# Altium project BauhallenUhr.PrjPcb
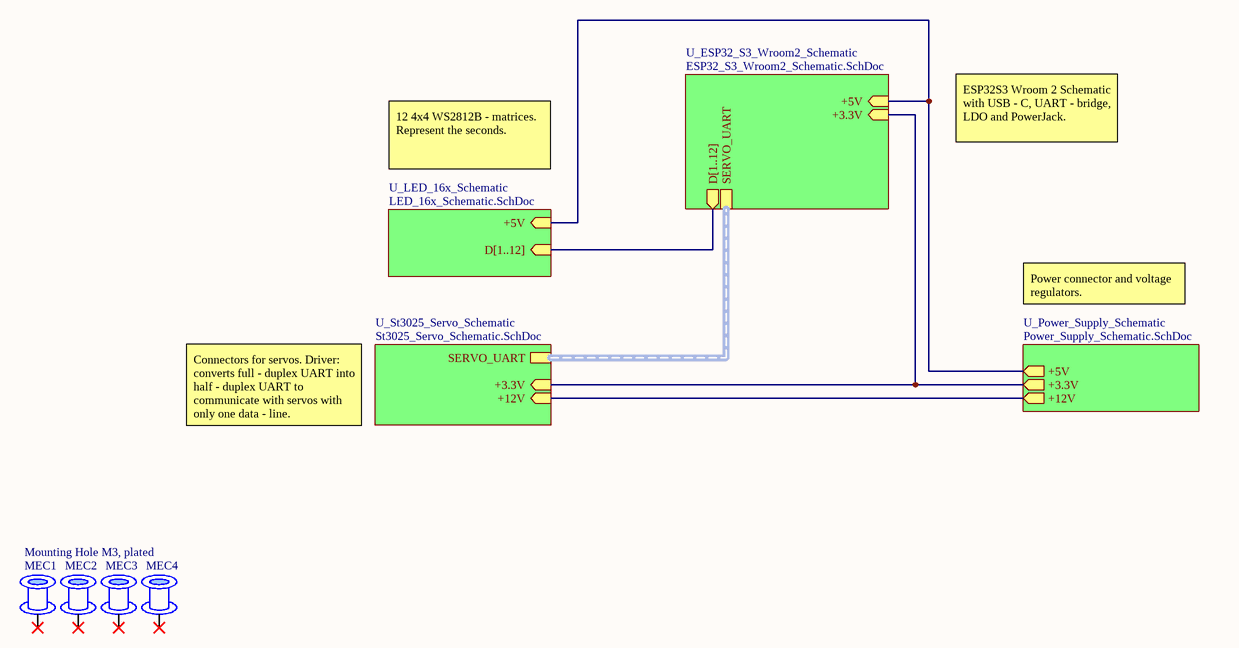
[diagram p0: Blackbox_BauhallenUhr_Schematic.SchDoc]
Author: Manuel Hueppi; Departement: DBAUG; Institut: IBK; Revision: V2.0
6 sheets, 130 parts. Net scope: hierarchical (ports join the sheet entries above them; power ports are global).
Board file: BauhallenUhr_Variante_4.PcbDoc
Sheets:
  Blackbox_BauhallenUhr_Schematic.SchDoc
    U_St3025_Servo_Schematic = St3025_Servo_Schematic.SchDoc
    U_ESP32_S3_Wroom2_Schematic = ESP32_S3_Wroom2_Schematic.SchDoc
    U_LED_16x_Schematic = LED_16x_Schematic.SchDoc
    U_Power_Supply_Schematic = Power_Supply_Schematic.SchDoc
  Brightness_Sensor_Schematic.SchDoc

## Sheet Blackbox_BauhallenUhr_Schematic.SchDoc
size A4; DocumentNumber: 1; SheetNumber: 1; SheetTotal: 5

### Parts
MEC1  Mounting Hole M3, plated  [Mounting Hole M3, plated]
MEC2  Mounting Hole M3, plated  [Mounting Hole M3, plated]  (value not drawn)
MEC3  Mounting Hole M3, plated  [Mounting Hole M3, plated]  (value not drawn)
MEC4  Mounting Hole M3, plated  [Mounting Hole M3, plated]  (value not drawn)

### Sub-sheets
U_ESP32_S3_Wroom2_Schematic = ESP32_S3_Wroom2_Schematic.SchDoc: SERVO_UART (harness SERVO_UART), D[1..12] (out), +5V (in), +3.3V (in)
U_LED_16x_Schematic = LED_16x_Schematic.SchDoc: D[1..12] (in), +5V (in)
U_Power_Supply_Schematic = Power_Supply_Schematic.SchDoc: +12V (out), +3.3V (out), +5V (out)
U_St3025_Servo_Schematic = St3025_Servo_Schematic.SchDoc: SERVO_UART (harness SERVO_UART), +3.3V (in), +12V (in)

### Nets
+3.3V: sheet U_St3025_Servo_Schematic/+3.3V, sheet U_ESP32_S3_Wroom2_Schematic/+3.3V, sheet U_Power_Supply_Schematic/+3.3V
+5V: sheet U_ESP32_S3_Wroom2_Schematic/+5V, sheet U_LED_16x_Schematic/+5V, sheet U_Power_Supply_Schematic/+5V
+12V: sheet U_St3025_Servo_Schematic/+12V, sheet U_Power_Supply_Schematic/+12V

Not connected (* = marked no-connect by the designer): MEC1 1*; MEC2 1*; MEC3 1*; MEC4 1*

### Buses and harness runs
bus sheet U_ESP32_S3_Wroom2_Schematic/D[1..12] = sheet U_LED_16x_Schematic/D[1..12]
harness sheet U_ESP32_S3_Wroom2_Schematic/SERVO_UART = sheet U_St3025_Servo_Schematic/SERVO_UART

### Notes on the sheet
- 12 4x4 WS2812B - matrices. Represent the seconds.
- ESP32S3 Wroom 2 Schematic with USB - C, UART - bridge, LDO and PowerJack.
- Power connector and voltage regulators.
- Connectors for servos. Driver: converts full - duplex UART into half - duplex UART to communicate with servos with only one data - line.
- Date:
- Title of drawing:
- Time:
- Drawn by:
- Project:
- Revision:
- Institut:
- Departement:
- Page:
- from:
- File:

### Library data of the parts
MEC1-MEC4 = Mounting Hole M3, plated: Mounting Hole for M3 Screw, plated to connect signal

## Sheet St3025_Servo_Schematic.SchDoc
size A4; DocumentNumber: 4; SheetNumber: 4; SheetTotal: 5
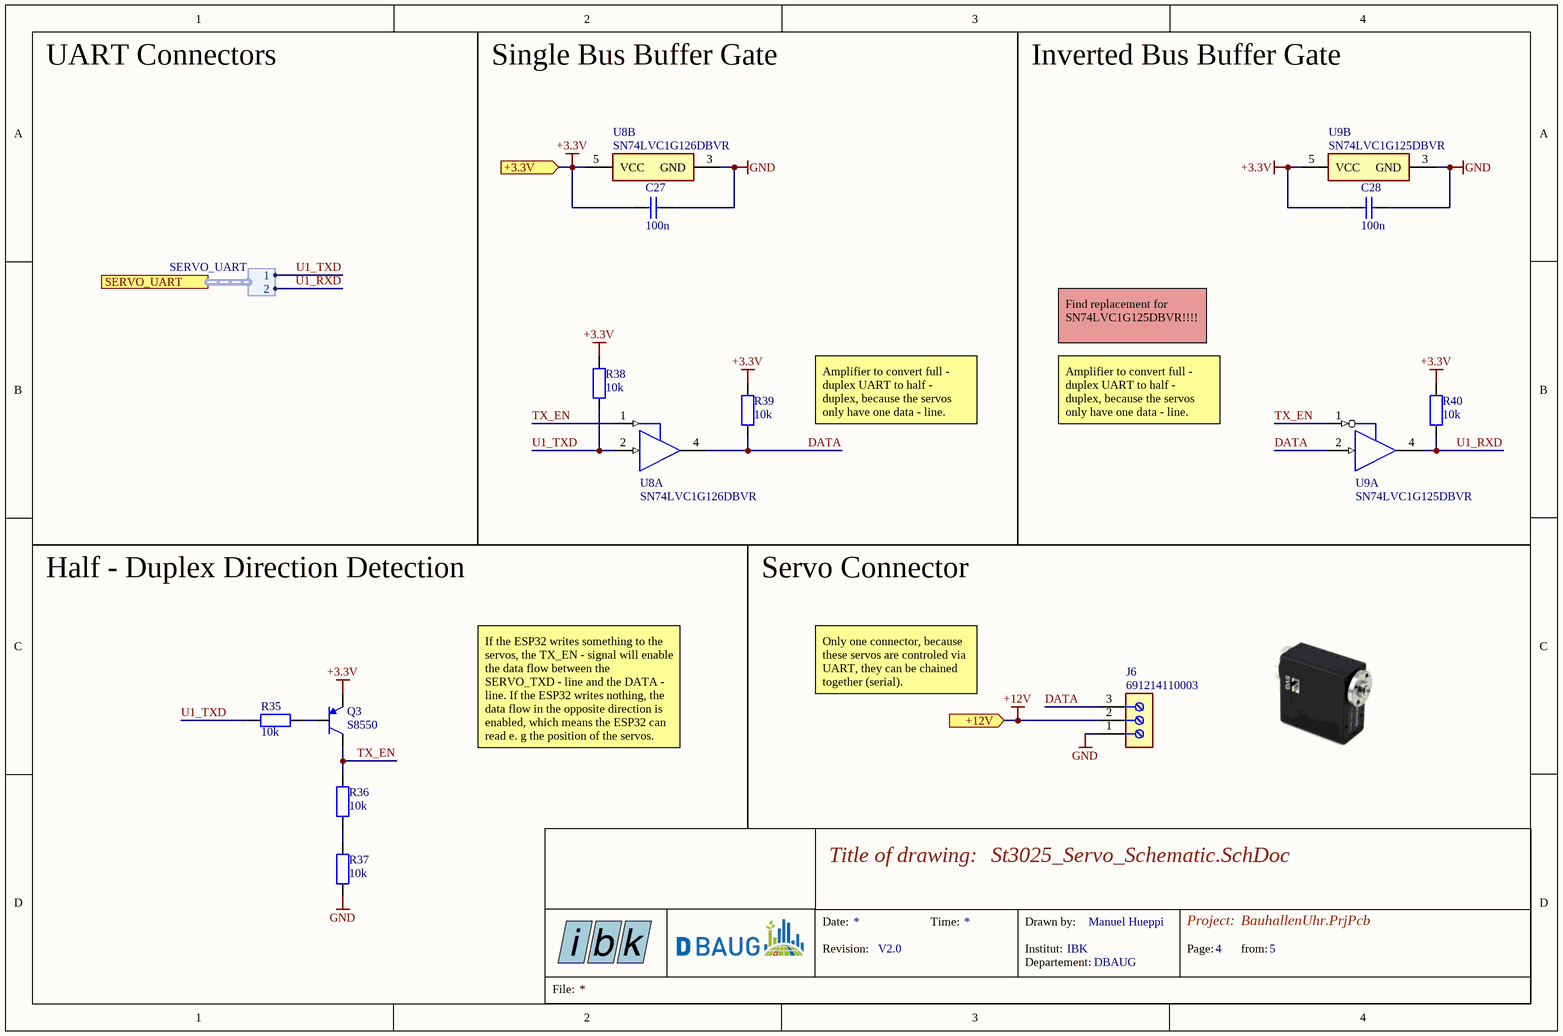
[diagram p1: St3025_Servo_Schematic.SchDoc]

### Parts
(Parts that share a designator on the sheet are numbered #1, #2 ... from top to bottom, then left to right.)
C27  100n  [0603_CAPACITOR]
C28  100n  [0603_CAPACITOR]
J6  691214110003  [Screw_Connector]
Q3  S8550  [PNP_Bipolar_Transistor]
R35  10k  [Resistor_0603]
R36  10k  [Resistor_0603]
R37  10k  [Resistor_0603]
R38#1  10k  [Resistor_0603]
R39#1  10k  [Resistor_0603]
R40#1  10k  [Resistor_0603]
U8  SN74LVC1G126DBVR  [DBV0005A_L_Single_Bus_Buffer_Gate]  (parts A,B of 2)
U9#1  SN74LVC1G125DBVR  [DBV0005A_L_Single_Bus_Buffer_Gate]  (parts A,B of 2)

### Ports
+3.3V (in), +12V (in), SERVO_UART (harness SERVO_UART)

### Harnesses
SERVO_UART: 1, 2

### Nets
+3.3V: C27.2 C28.2 Q3.2(E) R38#1.2 R39#1.2 R40#1.2 U8.5(VCC) U9#1.5(VCC) ; port +3.3V
+12V: J6.2 ; port +12V
GND: C27.1 C28.1 J6.1 R37.1 U8.3(GND) U9#1.3(GND)
DATA: J6.3 R39#1.1 U8.4(Y) U9#1.2(A)
TX_EN: Q3.3(C) R36.2 U8.1(OE) U9#1.1(OE)
U1_RXD: R40#1.1 U9#1.4(Y) ; port SERVO_UART.2
U1_TXD: R35.2 R38#1.1 U8.2(A) ; port SERVO_UART.1
NetQ3_1: Q3.1(B) R35.1
NetR36_1: R36.1 R37.2

### Notes on the sheet
- UART Connectors
- Single Bus Buffer Gate
- Inverted Bus Buffer Gate
- Find replacement for SN74LVC1G125DBVR!!!!
- Amplifier to convert full - duplex UART to half - duplex, because the servos only have one data - line.
- Half - Duplex Direction Detection
- Servo Connector
- Only one connector, because these servos are controled via UART, they can be chained together (serial).
- If the ESP32 writes something to the servos, the TX_EN - signal will enable the data flow between the SERVO_TXD - line and the DATA - line. If the ESP32 writes nothing, the data flow in the opposite direction is enabled, which means the ESP32 can read e. g the position of the servos.
- Date:
- Title of drawing:
- Time:
- Drawn by:
- Project:
- Revision:
- Institut:
- Departement:
- Page:
- from:
- File:

### Library data of the parts
C27 C28 = Capacitor_0603: 0603
J6 = Screw_Connector: 691214110003 Wurth Elektronik
Q3 = PNP_Bipolar_Transistor: Bipolar (BJT) Transistor PNP 25 V 500 mA 150MHz 300 mW Surface Mount SOT-23.
R35-R37 R38#1 R39#1 R40#1 = Resistor_0603: 0603
U8 = Single_Bus_Buffer_Gate: Single Bus Buffer Gate With 3-State Outputs, DBV0005A, LARGE T&R.; ComponentLink1Description: Supplier; ComponentLink1URL: https://www.digikey.com/en/products/detail/texas-instruments/SN74LVC1G126DBVR/385722
U9#1 = Single_Bus_Buffer_Gate_Inverted: Single Bus Buffer Gate With 3-State Outputs, DBV0005A, LARGE T&R.; ComponentLink1Description: Supplier; ComponentLink1URL: *

## Sheet ESP32_S3_Wroom2_Schematic.SchDoc
size A3; DocumentNumber: 3; SheetNumber: 3; SheetTotal: 5
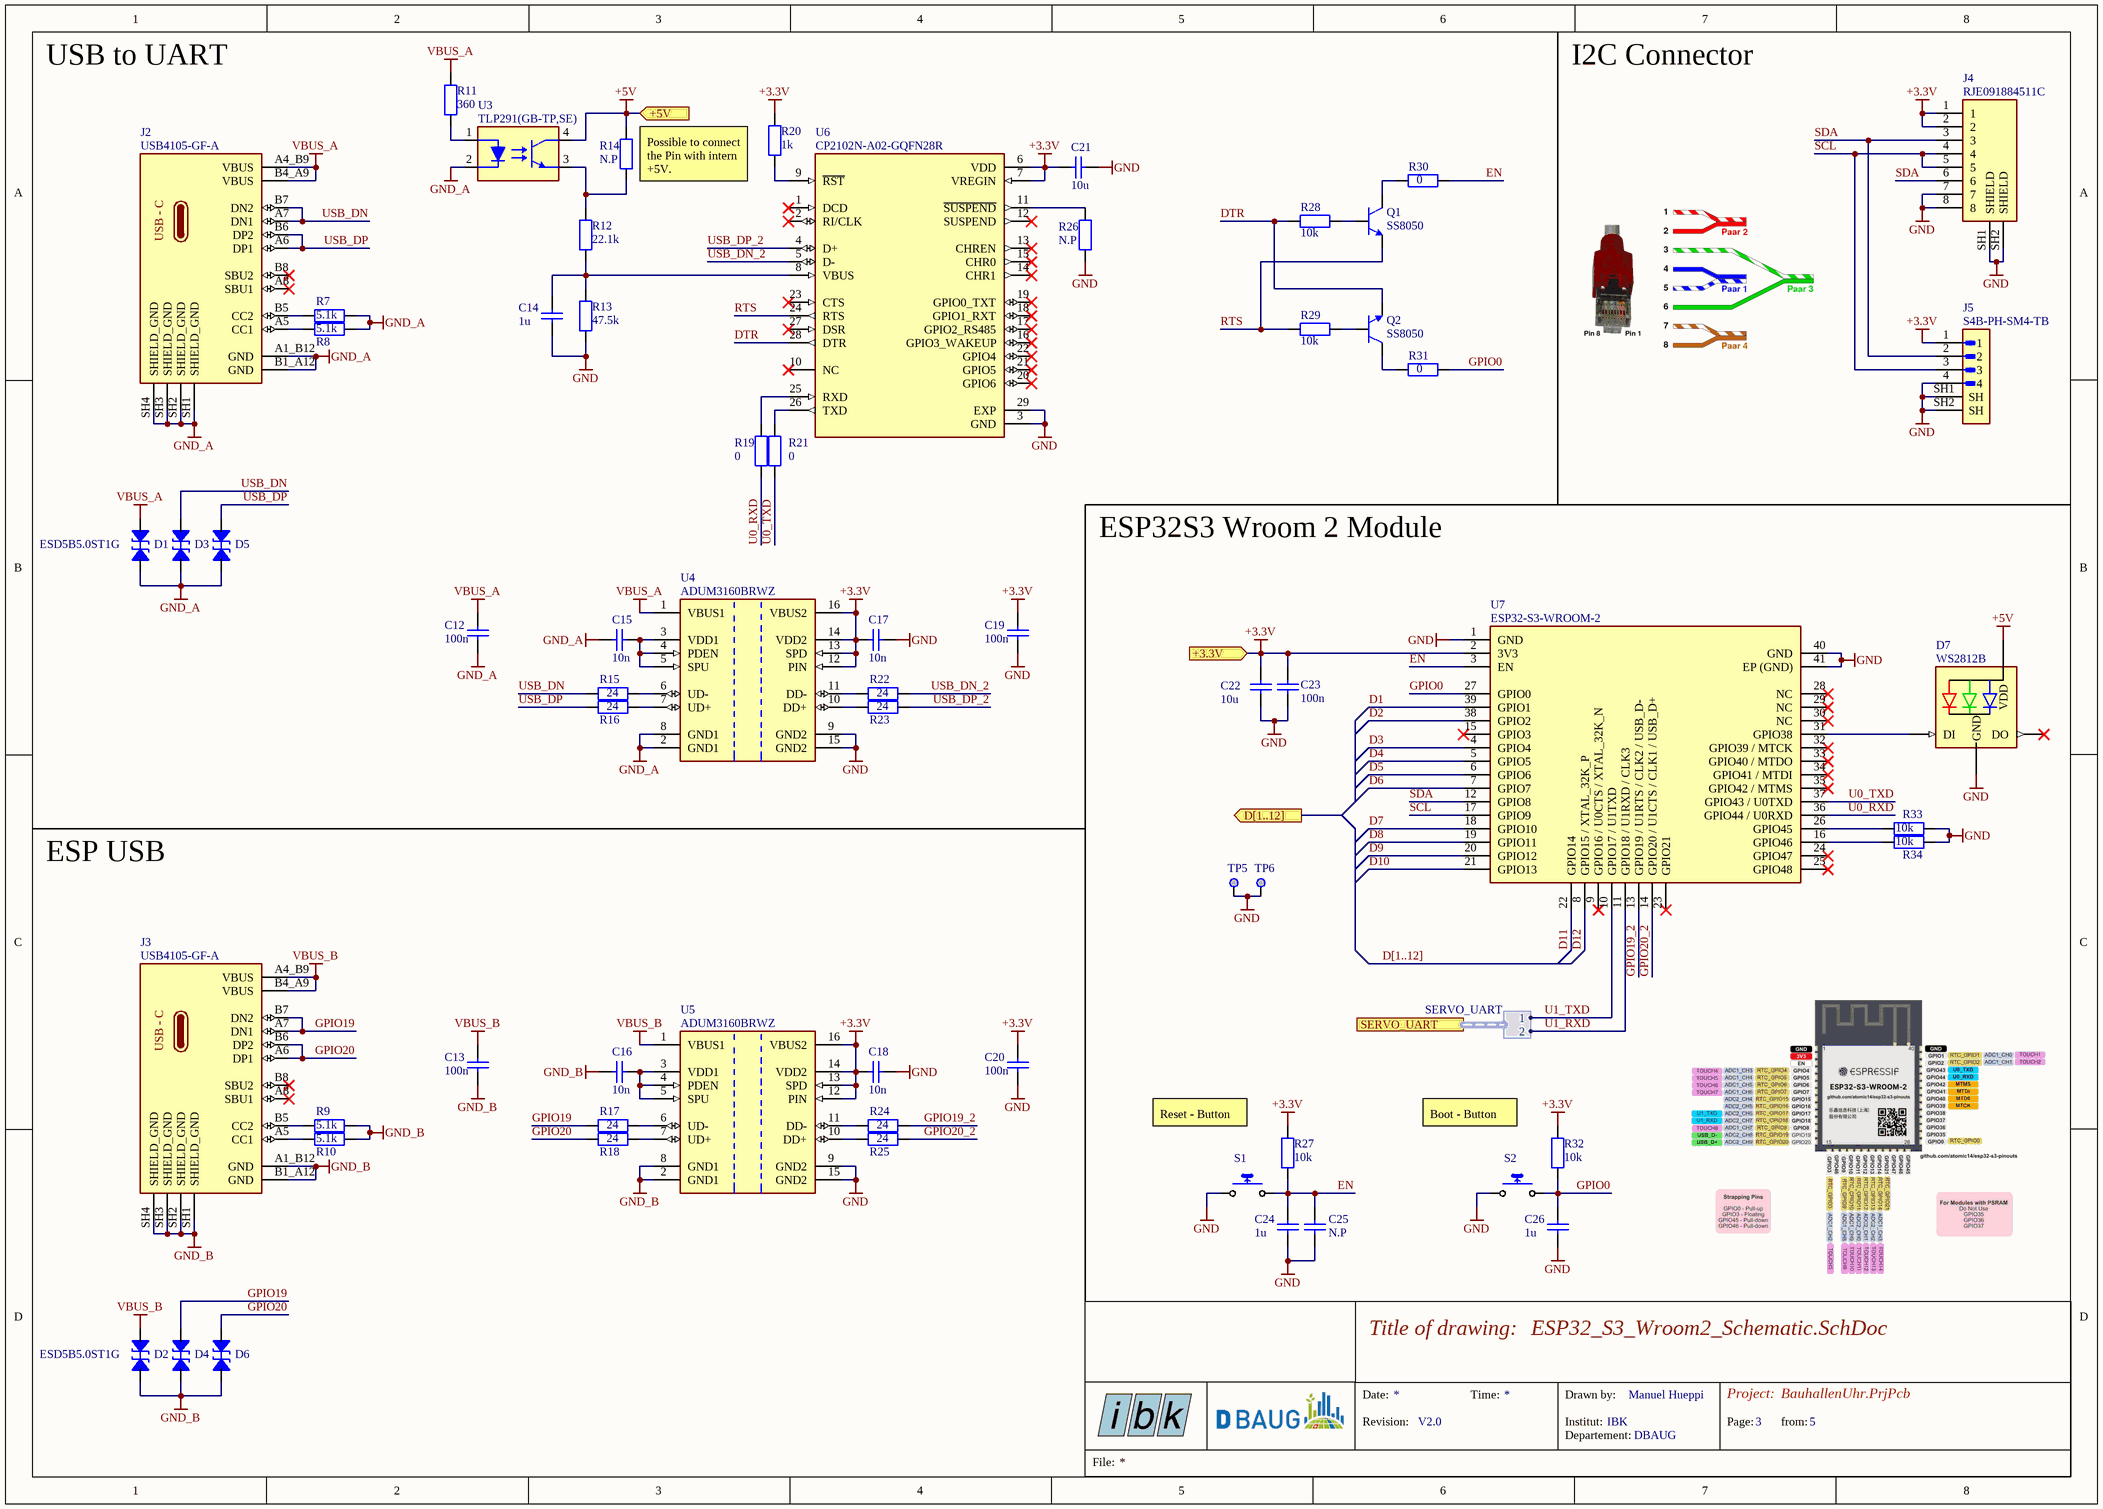
[diagram p2: ESP32_S3_Wroom2_Schematic.SchDoc]

### Parts
(Parts that share a designator on the sheet are numbered #1, #2 ... from top to bottom, then left to right.)
C12  100n  [0603_CAPACITOR]
C13  100n  [0603_CAPACITOR]
C14  1u  [0603_CAPACITOR]
C15  10n  [0603_CAPACITOR]
C16  10n  [0603_CAPACITOR]
C17  10n  [0603_CAPACITOR]
C18  10n  [0603_CAPACITOR]
C19  100n  [0603_CAPACITOR]
C20  100n  [0603_CAPACITOR]
C21  10u  [Capacitor_0805]
C22#1  10u  [Capacitor_0805]
C23#1  100n  [0603_CAPACITOR]
C24  1u  [0603_CAPACITOR]
C25  N.P  [Capacitor_1206]
C26  1u  [0603_CAPACITOR]
D1  ESD5B5.0ST1G  [ESD_Protecction_Diode]
D2  ESD5B5.0ST1G  [ESD_Protecction_Diode]
D3  ESD5B5.0ST1G  [ESD_Protecction_Diode]  (value not drawn)
D4  ESD5B5.0ST1G  [ESD_Protecction_Diode]  (value not drawn)
D5  ESD5B5.0ST1G  [ESD_Protecction_Diode]  (value not drawn)
D6  ESD5B5.0ST1G  [ESD_Protecction_Diode]  (value not drawn)
D7  WS2812B  [WS2812B]
J2  USB4105-GF-A  [USB4105-GF-A]
J3  USB4105-GF-A  [USB4105-GF-A]
J4  RJE091884511C  [RJ45]
J5  S4B-PH-SM4-TB  [Connector_SMD_Lying]
Q1  SS8050  [NPN_Bipolar_Transistor]
Q2  SS8050  [NPN_Bipolar_Transistor]
R7  5.1k  [Resistor_0603]
R8  5.1k  [Resistor_0603]
R9  5.1k  [Resistor_0603]
R10  5.1k  [Resistor_0603]
R11  360  [Resistor_0603]
R12  22.1k  [Resistor_0603]
R13  47.5k  [Resistor_0603]
R14  N.P  [1206_Resistor]
R15  24  [Resistor_0603]
R16  24  [Resistor_0603]
R17  24  [Resistor_0603]
R18  24  [Resistor_0603]
R19  0  [1206_Resistor]
R20  1k  [Resistor_0603]
R21  0  [1206_Resistor]
R22  24  [Resistor_0603]
R23  24  [Resistor_0603]
R24  24  [Resistor_0603]
R25  24  [Resistor_0603]
R26  N.P  [1206_Resistor]
R27  10k  [Resistor_0603]
R28  10k  [Resistor_0603]
R29  10k  [Resistor_0603]
R30  0  [1206_Resistor]
R31  0  [1206_Resistor]
R32  10k  [Resistor_0603]
R33  10k  [Resistor_0603]
R34  10k  [Resistor_0603]
S1  ?  [PTS636SK25SMTR]  (value not drawn)
S2  ?  [PTS636SK25SMTR]  (value not drawn)
TP5  Testpoint S2761-46R  [Testpoint S2761-46R]  (value not drawn)
TP6  Testpoint S2761-46R  [Testpoint S2761-46R]  (value not drawn)
U3  TLP291(GB-TP,SE)  [Optocoupler]
U4  ADUM3160BRWZ  [USB_Digital_Isolator_A]
U5  ADUM3160BRWZ  [USB_Digital_Isolator_A]
U6  CP2102N-A02-GQFN28R  [CP2102N-A02-GQFN28R]
U7  ESP32-S3-WROOM-2  [ESP32-S3-WROOM-2]

### Ports
+3.3V (in), +5V (in), D[1..12] (out), SERVO_UART (harness SERVO_UART)

### Harnesses
SERVO_UART: 1, 2

### Nets
+3.3V: C17.2 C18.2 C19.2 C20.2 C21.2 C22#1.1 C23#1.2 J4.1 J4.2 J5.1 R20.1 R27.2 R32.2 U4.12(PIN) U4.13(SPD) U4.14(VDD2) U4.16(VBUS2) U5.12(PIN) U5.13(SPD) U5.14(VDD2) U5.16(VBUS2) U6.6(VDD) U6.7(VREGIN) U7.2(3V3) ; port +3.3V
+5V: D7.1(VDD) R14.1 U3.4(COL) ; port +5V
GND: C14.1 C17.1 C18.1 C19.1 C20.1 C21.1 C22#1.2 C23#1.1 C24.1 C25.1 C26.1 D7.3(GND) J4.7 J4.8 J4.SH1(SHIELD) J4.SH2(SHIELD) J5.4 J5.SH1(SH) J5.SH2(SH) R13.2 R26.2 R33.1 R34.1 S1.1 S2.1 TP5.1 TP6.1 U4.9(GND2) U4.15(GND2) U5.9(GND2) U5.15(GND2) U6.3(GND) U6.29(EXP) U7.1(GND) U7.40(GND) U7.41(EP_(GND))
GND_A: C12.1 C15.2 D1.A(P$1) D3.A(P$1) D5.A(P$1) J2.A1_B12(GND) J2.B1_A12(GND) J2.SH1(SHIELD_GND) J2.SH2(SHIELD_GND) J2.SH3(SHIELD_GND) J2.SH4(SHIELD_GND) R7.1 R8.1 U3.2(C) U4.2(GND1) U4.8(GND1)
GND_B: C13.1 C16.2 D2.A(P$1) D4.A(P$1) D6.A(P$1) J3.A1_B12(GND) J3.B1_A12(GND) J3.SH1(SHIELD_GND) J3.SH2(SHIELD_GND) J3.SH3(SHIELD_GND) J3.SH4(SHIELD_GND) R9.1 R10.1 U5.2(GND1) U5.8(GND1)
VBUS_A: C12.2 D1.K(P$2) J2.A4_B9(VBUS) J2.B4_A9(VBUS) R11.1 U4.1(VBUS1)
VBUS_B: C13.2 D2.K(P$2) J3.A4_B9(VBUS) J3.B4_A9(VBUS) U5.1(VBUS1)
D1: U7.39(GPIO1)
D2: U7.38(GPIO2)
D3: U7.4(GPIO4)
D4: U7.5(GPIO5)
D5: U7.6(GPIO6)
D6: U7.7(GPIO7)
D7: U7.18(GPIO10)
D8: U7.19(GPIO11)
D9: U7.20(GPIO12)
D10: U7.21(GPIO13)
D11: U7.22(GPIO14)
D12: U7.8(GPIO15_/_XTAL_32K_P)
DTR: Q2.2(E) R28.2 U6.28(DTR)
EN: C24.2 C25.2 R27.1 R30.2 S1.2 U7.3(EN)
GPIO0: C26.2 R31.2 R32.1 S2.2 U7.27(GPIO0)
GPIO19: D4.K(P$2) J3.A7(DN1) J3.B7(DN2) R17.2
GPIO19_2: R24.1 U7.13(GPIO19_/_U1RTS_/_CLK2_/_USB_D-)
GPIO20: D6.K(P$2) J3.A6(DP1) J3.B6(DP2) R18.2
GPIO20_2: R25.1 U7.14(GPIO20_/_U1CTS_/_CLK1_/_USB_D+)
RTS: Q1.2(E) R29.2 U6.24(RTS)
SCL: J4.4 J4.5 J5.3 U7.17(GPIO9)
SDA: J4.3 J4.6 J5.2 U7.12(GPIO8)
U0_RXD: R19.1 U7.36(GPIO44_/_U0RXD)
U0_TXD: R21.1 U7.37(GPIO43_/_U0TXD)
U1_RXD: U7.11(GPIO18_/_U1RXD_/_CLK3) ; port SERVO_UART.2
U1_TXD: U7.10(GPIO17_/_U1TXD) ; port SERVO_UART.1
USB_DN: D3.K(P$2) J2.A7(DN1) J2.B7(DN2) R15.2
USB_DN_2: R22.1 U6.5(D-)
USB_DP: D5.K(P$2) J2.A6(DP1) J2.B6(DP2) R16.2
USB_DP_2: R23.1 U6.4(D+)
NetC14_2: C14.2 R12.2 R13.1 U6.8(VBUS)
NetC15_1: C15.1 U4.3(VDD1) U4.4(PDEN) U4.5(SPU)
NetC16_1: C16.1 U5.3(VDD1) U5.4(PDEN) U5.5(SPU)
NetD7_4: D7.4(DI) U7.31(GPIO38)
NetJ2_A5: J2.A5(CC1) R8.2
NetJ2_B5: J2.B5(CC2) R7.2
NetJ3_A5: J3.A5(CC1) R10.2
NetJ3_B5: J3.B5(CC2) R9.2
NetQ1_1: Q1.1(B) R28.1
NetQ1_3: Q1.3(C) R30.1
NetQ2_1: Q2.1(B) R29.1
NetQ2_3: Q2.3(C) R31.1
NetR11_2: R11.2 U3.1(A)
NetR12_1: R12.1 R14.2 U3.3(EMIT)
NetR15_1: R15.1 U4.6(UD-)
NetR16_1: R16.1 U4.7(UD+)
NetR17_1: R17.1 U5.6(UD-)
NetR18_1: R18.1 U5.7(UD+)
NetR19_2: R19.2 U6.25(RXD)
NetR20_2: R20.2 U6.9(~{RST})
NetR21_2: R21.2 U6.26(TXD)
NetR22_2: R22.2 U4.11(DD-)
NetR23_2: R23.2 U4.10(DD+)
NetR24_2: R24.2 U5.11(DD-)
NetR25_2: R25.2 U5.10(DD+)
NetR26_1: R26.1 U6.11(~{SUSPEND})
NetR33_2: R33.2 U7.26(GPIO45)
NetR34_2: R34.2 U7.16(GPIO46)

Not connected (* = marked no-connect by the designer): D7 2(DO)*; J2 A8(SBU1)* B8(SBU2)*; J3 A8(SBU1)* B8(SBU2)*; U6 1(DCD)* 2(RI/CLK)* 10(NC)* 12(SUSPEND)* 13(CHREN)* 14(CHR1)* 15(CHR0)* 16(GPIO3_WAKEUP)* 17(GPIO2_RS485)* 18(GPIO1_RXT)* 19(GPIO0_TXT)* 20(GPIO6)* 21(GPIO5)* 22(GPIO4)* 23(CTS)* 27(DSR)*; U7 9(GPIO16_/_U0CTS_/_XTAL_32K_N)* 15(GPIO3)* 23(GPIO21)* 24(GPIO47)* 25(GPIO48)* 28(NC)* 29(NC)* 30(NC)* 32(GPIO39_/_MTCK)* 33(GPIO40_/_MTDO)* 34(GPIO41_/_MTDI)* 35(GPIO42_/_MTMS)*

### Buses and harness runs
bus D[1..12] = port D[1..12]

### Notes on the sheet
- USB to UART
- I2C Connector
- (near R14) Possible to connect the Pin with intern +5V.
- ESP32S3 Wroom 2 Module
- ESP USB
- (near R27) Reset - Button
- (near R32) Boot - Button
- Date:
- Title of drawing:
- Time:
- Drawn by:
- Project:
- Revision:
- Institut:
- Departement:
- Page:
- from:
- File:
- (in symbol USB4105-GF-A) USB - C

### Library data of the parts
C12-C20 C23#1 C24 C26 = Capacitor_0603: 0603
C21 C22#1 = Capacitor_0805: 0805
C25 = Capacitor_1206: 1206
D1-D6 = ESD_Protection_Diode: ComponentLink1Description: Supplier; ComponentLink1URL: https://www.digikey.com/en/products/detail/onsemi/ESD5B5-0ST1G/1792206
J2 J3 = USB4105-GF-A: USB - C - Port
J4 = RJ45: Jack Modular Connector 8p8c (RJ45, Ethernet) 90Â° Angle (Right) Shielded Cat3.; MF: Amphenol ICC (Commercial Products); SnapEDA_Link: https://www.snapeda.com/parts/RJE091884511C/Amphenol/view-part/?ref=snap; Package: None; System: Connector; MP: RJE091884511C; Check_prices: https://www.snapeda.com/parts/RJE091884511C/Amphenol/view-part/?ref=eda; Parameter 1: *
J5 = Connector_SMD_Lying_Small_Symbol: Connector Header Surface Mount, Right Angle 4 position 0.079 (2.00mm).; ComponentLink1Description: Supplier; ComponentLink1URL: https://www.digikey.ch/de/products/detail/jst-sales-america-inc/S4B-PH-SM4-TB/926657?s=N4IgTCBcDaIMoBYBCBaACgCRXAsglAKkiALoC%2BQA
Q1 Q2 = NPN_Bipolar_Transistor: SS8050 SOT - 23.; ComponentLink1Description: Supplier; ComponentLink1URL: https://www.digikey.com/en/products/detail/guangdong-inmark-electronics-co-ltd/SS8050/28539054
R7-R13 R15-R18 R20 R22-R25 R27-R29 R32-R34 = Resistor_0603: 0603
R14 R19 R21 R26 R30 R31 = Resistor_1206: 1206
S1 S2 = Button
TP5 TP6 = Testpoint S2761-46R: Prüfstecker und Messbuchsen EZ BoardWare S27 SMT Mini Test Terminal, Reel
U3 = Optocoupler: Optoisolator Transistor Output 3750Vrms 1 Channel 4-SO.
U4 U5 = USB_Digital_Isolator: DGT ISOL 2500VRMS 2CH USB 16SOIC.
U6 = CP2102N-A02-GQFN28R: USB to UART bridge.; ComponentLink1Description: Datasheet; ComponentLink1URL: chrome-extension://efaidnbmnnnibpcajpcglclefindmkaj/https://www.silabs.com/documents/public/data-sheets/cp2102n-datasheet.pdf; ComponentLink2Description: Supplierlink; ComponentLink2URL: https://www.digikey.ch/en/products/detail/silicon-laboratories-inc/CP2102N-A02-GQFN28R/9863486?utm_source=findchips&utm_medium=aggregator&utm_campaign=buynow
U7 = ESP32-S3-WROOM-2-N32R16V: Bluetooth, WiFi 802.11b/g/n, Bluetooth v5.0 Transceiver Module 2.4GHz PCB Trace Surface Mount; Manufacturer: Espressif Systems; Latest Revision Made By: Simon Gimple; Latest Revision Note: New Part; Assembly Technology: SMD; Latest Revision Date: 17.10.2025; Manufacturer Part Number: ESP32-S3-WROOM-2-N32R16V; Note Schematic: *; SMS-Lab Part Number: *; Supplier 1: DigiKey; Supplier 2: Mouser; Supplier 3: *; Supplier 1 Part Number: 1965-ESP32-S3-WROOM-2-N32R16VCT-ND; Supplier 2 Part Number: 356-SP32S3WM2N32R16V; Supplier 3 Part Number: *; Value: *; ComponentLink1Description: Show Datasheet on SMS Drive; ComponentLink1URL: P:\Electronic Workshop\Datasheets (Refered in Libraries - Don't Change!)\ESP32-S3-WROOM-2-N32R16V_Digikey_1965-ESP32-S3-WROOM-2-N32R16VCT-ND.pdf

## Sheet LED_16x_Schematic.SchDoc
size A4; DocumentNumber: 5; SheetNumber: 5; SheetTotal: 5
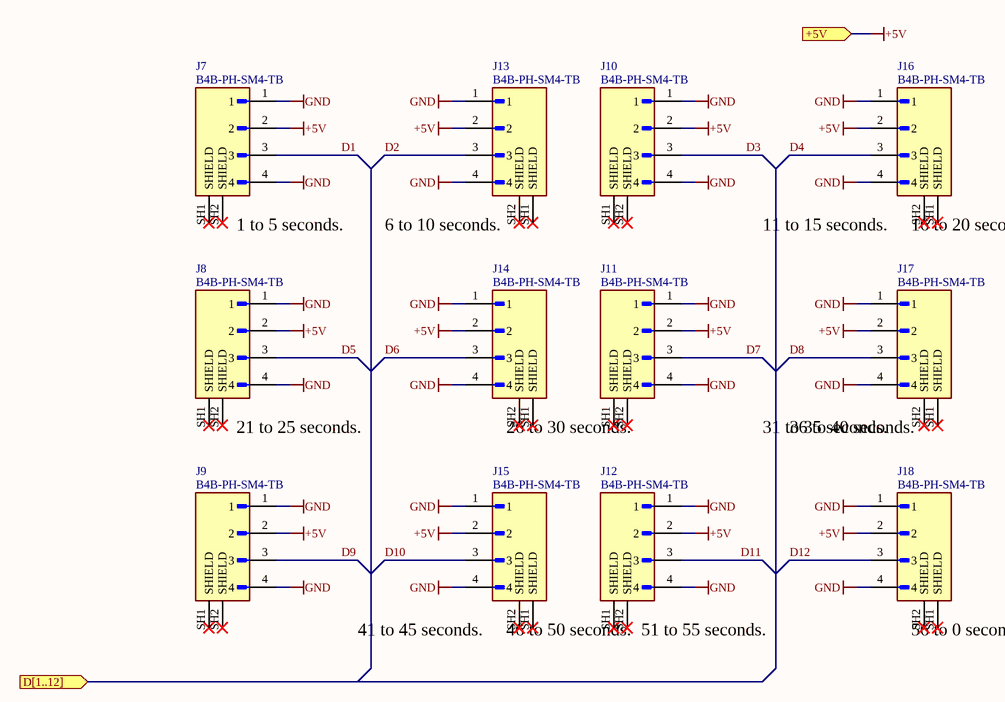
[diagram p3: LED_16x_Schematic.SchDoc]

### Parts
J7  B4B-PH-SM4-TB  [Connector_SMD]
J8  B4B-PH-SM4-TB  [Connector_SMD]
J9  B4B-PH-SM4-TB  [Connector_SMD]
J10  B4B-PH-SM4-TB  [Connector_SMD]
J11  B4B-PH-SM4-TB  [Connector_SMD]
J12  B4B-PH-SM4-TB  [Connector_SMD]
J13  B4B-PH-SM4-TB  [Connector_SMD]
J14  B4B-PH-SM4-TB  [Connector_SMD]
J15  B4B-PH-SM4-TB  [Connector_SMD]
J16  B4B-PH-SM4-TB  [Connector_SMD]
J17  B4B-PH-SM4-TB  [Connector_SMD]
J18  B4B-PH-SM4-TB  [Connector_SMD]

### Ports
+5V (in), D[1..12] (in)

### Nets
+5V: J7.2 J8.2 J9.2 J10.2 J11.2 J12.2 J13.2 J14.2 J15.2 J16.2 J17.2 J18.2 ; port +5V
GND: J7.1 J7.4 J8.1 J8.4 J9.1 J9.4 J10.1 J10.4 J11.1 J11.4 J12.1 J12.4 J13.1 J13.4 J14.1 J14.4 J15.1 J15.4 J16.1 J16.4 J17.1 J17.4 J18.1 J18.4
D1: J7.3
D2: J13.3
D3: J10.3
D4: J16.3
D5: J8.3
D6: J14.3
D7: J11.3
D8: J17.3
D9: J9.3
D10: J15.3
D11: J12.3
D12: J18.3

Not connected (* = marked no-connect by the designer): J7 SH1(SHIELD)* SH2(SHIELD)*; J8 SH1(SHIELD)* SH2(SHIELD)*; J9 SH1(SHIELD)* SH2(SHIELD)*; J10 SH1(SHIELD)* SH2(SHIELD)*; J11 SH1(SHIELD)* SH2(SHIELD)*; J12 SH1(SHIELD)* SH2(SHIELD)*; J13 SH1(SHIELD)* SH2(SHIELD)*; J14 SH1(SHIELD)* SH2(SHIELD)*; J15 SH1(SHIELD)* SH2(SHIELD)*; J16 SH1(SHIELD)* SH2(SHIELD)*; J17 SH1(SHIELD)* SH2(SHIELD)*; J18 SH1(SHIELD)* SH2(SHIELD)*

### Notes on the sheet
- (near J7) 1 to 5 seconds.
- (near J13) 6 to 10 seconds.
- (near J10) 11 to 15 seconds.
- (near J16) 16 to 20 seconds.
- (near J8) 21 to 25 seconds.
- (near J14) 26 to 30 seconds.
- (near J11) 31 to 35 seconds.
- (near J17) 36 to 40 seconds.
- (near J9) 41 to 45 seconds.
- (near J15) 46 to 50 seconds.
- (near J12) 51 to 55 seconds.
- (near J18) 56 to 0 seconds.
- Date:
- Title of drawing:
- Time:
- Drawn by:
- Project:
- Revision:
- Institut:
- Departement:
- Page:
- from:
- File:

### Library data of the parts
J7-J18 = Connector_SMD: CONN HEADER SMD 4POS 2MM.; ComponentLink1Description: Supplier; ComponentLink1URL: https://www.digikey.ch/en/products/detail/jst-sales-america-inc/B4B-PH-SM4-TB/926643

## Sheet Power_Supply_Schematic.SchDoc
size A4; DocumentNumber: 2; SheetNumber: 2; SheetTotal: 5
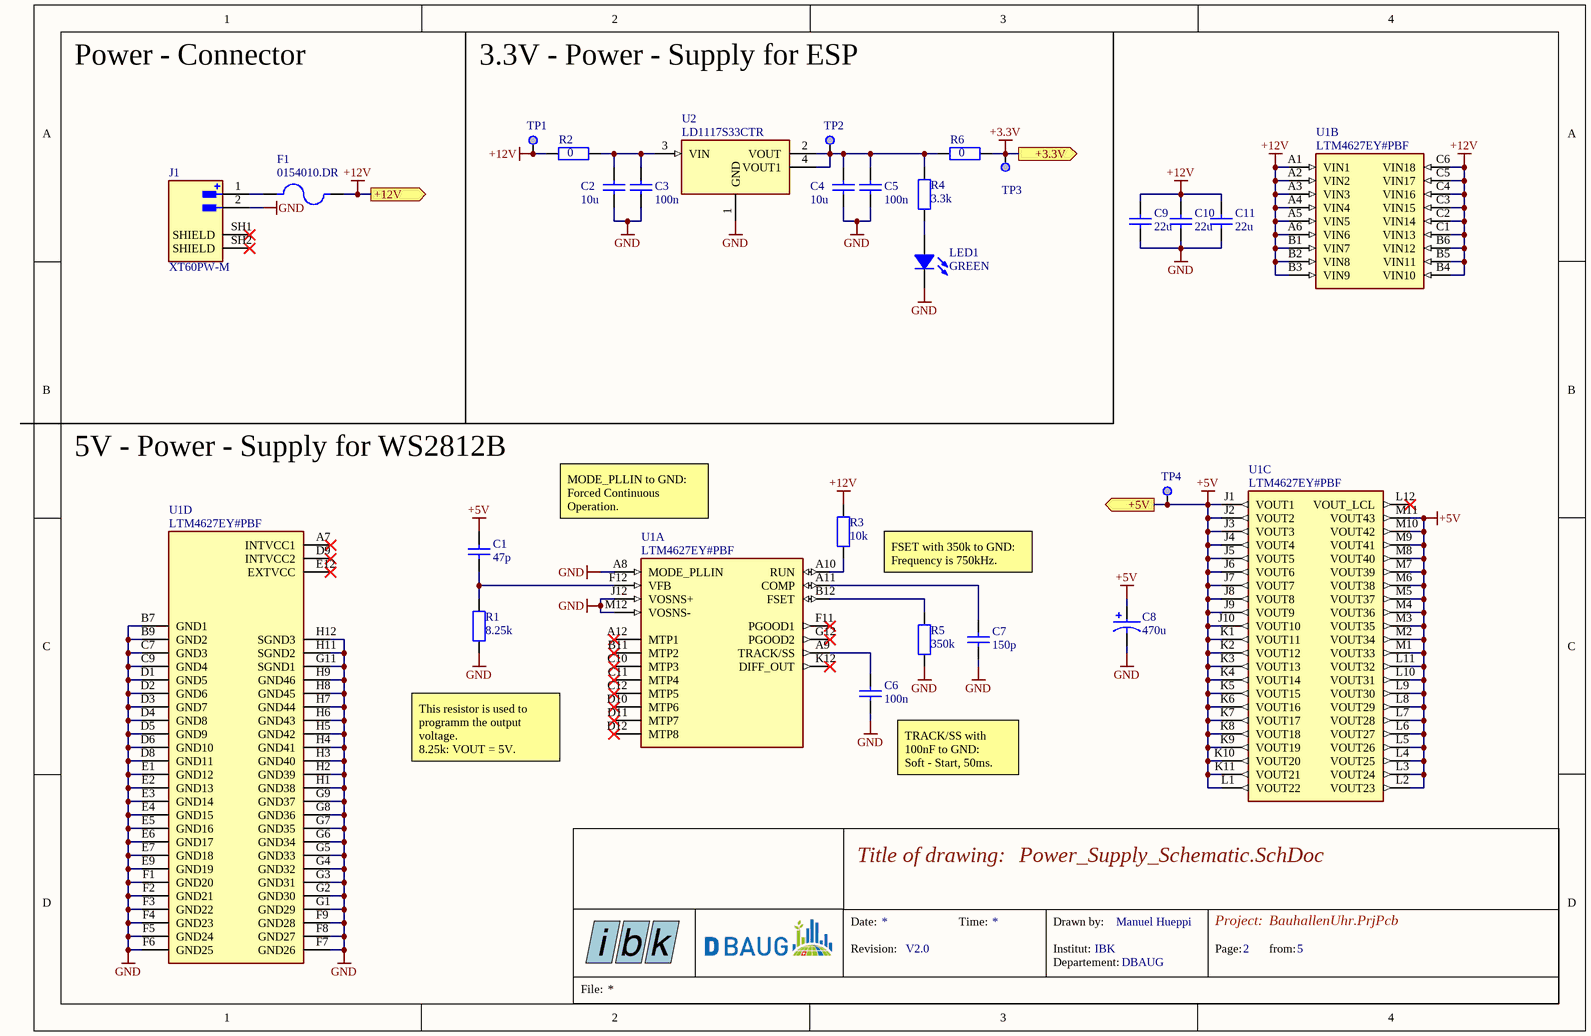
[diagram p4: Power_Supply_Schematic.SchDoc]

### Parts
C1  47p  [0603_CAPACITOR]
C2  10u  [Capacitor_0805]
C3  100n  [0603_CAPACITOR]
C4  10u  [Capacitor_0805]
C5  100n  [0603_CAPACITOR]
C6  100n  [0603_CAPACITOR]
C7  150p  [0603_CAPACITOR]
C8  470u  [Capacitor_Tantalum]
C9  22u  [Capacitor_0805]
C10  22u  [Capacitor_0805]
C11  22u  [Capacitor_0805]
F1  0154010.DR  [Fuse]
J1  XT60PW-M  [PCB_Connector]
LED1  GREEN  [LED_0603, GREEN]
R1  8.25k  [Resistor_0603]
R2  0  [1206_Resistor]
R3  10k  [Resistor_0603]
R4  3.3k  [Resistor_0603]
R5  350k  [Resistor_0603]
R6  0  [1206_Resistor]
TP1  Testpoint S2761-46R  [Testpoint S2761-46R]  (value not drawn)
TP2  Testpoint S2761-46R  [Testpoint S2761-46R]  (value not drawn)
TP3  Testpoint S2761-46R  [Testpoint S2761-46R]  (value not drawn)
TP4  Testpoint S2761-46R  [Testpoint S2761-46R]  (value not drawn)
U1  LTM4627EY#PBF  [DCDC_Converter]  (parts A,B,C,D of 4)
U2  LD1117S33CTR  [LD1117S33CTR]

### Ports
+3.3V (out), +5V (out), +12V (out)

### Nets
+3.3V: R6.2 TP3.1 ; port +3.3V
+5V: C1.2 C8.1 TP4.1 U1.J1(VOUT1) U1.J2(VOUT2) U1.J3(VOUT3) U1.J4(VOUT4) U1.J5(VOUT5) U1.J6(VOUT6) U1.J7(VOUT7) U1.J8(VOUT8) U1.J9(VOUT9) U1.J10(VOUT10) U1.K1(VOUT11) U1.K2(VOUT12) U1.K3(VOUT13) U1.K4(VOUT14) U1.K5(VOUT15) U1.K6(VOUT16) U1.K7(VOUT17) U1.K8(VOUT18) U1.K9(VOUT19) U1.K10(VOUT20) U1.K11(VOUT21) U1.L1(VOUT22) U1.L2(VOUT23) U1.L3(VOUT24) U1.L4(VOUT25) U1.L5(VOUT26) U1.L6(VOUT27) U1.L7(VOUT28) U1.L8(VOUT29) U1.L9(VOUT30) U1.L10(VOUT31) U1.L11(VOUT32) U1.M1(VOUT33) U1.M2(VOUT34) U1.M3(VOUT35) U1.M4(VOUT36) U1.M5(VOUT37) U1.M6(VOUT38) U1.M7(VOUT39) U1.M8(VOUT40) U1.M9(VOUT41) U1.M10(VOUT42) U1.M11(VOUT43) ; port +5V
+12V: C9.2 C10.2 C11.2 F1.2 R2.1 R3.2 TP1.1 U1.A1(VIN1) U1.A2(VIN2) U1.A3(VIN3) U1.A4(VIN4) U1.A5(VIN5) U1.A6(VIN6) U1.B1(VIN7) U1.B2(VIN8) U1.B3(VIN9) U1.B4(VIN10) U1.B5(VIN11) U1.B6(VIN12) U1.C1(VIN13) U1.C2(VIN14) U1.C3(VIN15) U1.C4(VIN16) U1.C5(VIN17) U1.C6(VIN18) ; port +12V
GND: C2.1 C3.1 C4.1 C5.1 C6.1 C7.1 C8.2 C9.1 C10.1 C11.1 J1.2(N) LED1.K R1.1 R5.1 U1.A8(MODE_PLLIN) U1.B7(GND1) U1.B9(GND2) U1.C7(GND3) U1.C9(GND4) U1.D1(GND5) U1.D2(GND6) U1.D3(GND7) U1.D4(GND8) U1.D5(GND9) U1.D6(GND10) U1.D8(GND11) U1.E1(GND12) U1.E2(GND13) U1.E3(GND14) U1.E4(GND15) U1.E5(GND16) U1.E6(GND17) U1.E7(GND18) U1.E9(GND19) U1.F1(GND20) U1.F2(GND21) U1.F3(GND22) U1.F4(GND23) U1.F5(GND24) U1.F6(GND25) U1.F7(GND26) U1.F8(GND27) U1.F9(GND28) U1.G1(GND29) U1.G2(GND30) U1.G3(GND31) U1.G4(GND32) U1.G5(GND33) U1.G6(GND34) U1.G7(GND35) U1.G8(GND36) U1.G9(GND37) U1.G11(SGND1) U1.H1(GND38) U1.H2(GND39) U1.H3(GND40) U1.H4(GND41) U1.H5(GND42) U1.H6(GND43) U1.H7(GND44) U1.H8(GND45) U1.H9(GND46) U1.H11(SGND2) U1.H12(SGND3) U1.J12(VOSNS+) U1.M12(VOSNS-) U2.1(GND)
NetC1_1: C1.1 R1.2 U1.F12(VFB)
NetC2_2: C2.2 C3.2 R2.2 U2.3(VIN)
NetC4_2: C4.2 C5.2 R4.2 R6.1 TP2.1 U2.2(VOUT) U2.4(VOUT1)
NetC6_2: C6.2 U1.A9(TRACK/SS)
NetC7_2: C7.2 U1.A11(COMP)
NetF1_1: F1.1 J1.1(P)
NetLED1_A: LED1.A R4.1
NetR3_1: R3.1 U1.A10(RUN)
NetR5_2: R5.2 U1.B12(FSET)

Not connected (* = marked no-connect by the designer): J1 SH1(SHIELD)* SH2(SHIELD)*; U1 A7(INTVCC1)* A12(MTP1)* B11(MTP2)* C10(MTP3)* C11(MTP4)* C12(MTP5)* D9(INTVCC2)* D10(MTP6)* D11(MTP7)* D12(MTP8)* E12(EXTVCC)* F11(PGOOD1)* G12(PGOOD2)* K12(DIFF_OUT)* L12(VOUT_LCL)*

### Notes on the sheet
- Power - Connector
- 3.3V - Power - Supply for ESP
- 5V - Power - Supply for WS2812B
- MODE_PLLIN to GND:
  Forced Continuous Operation.
- FSET with 350k to GND:
  Frequency is 750kHz.
- This resistor is used to programm the output voltage.
  8.25k: VOUT = 5V.
- (near C6) TRACK/SS with 100nF to GND:
  Soft - Start, 50ms.
- Date:
- Title of drawing:
- Time:
- Drawn by:
- Project:
- Revision:
- Institut:
- Departement:
- Page:
- from:
- File:

### Library data of the parts
C1 C3 C5-C7 = Capacitor: 0603
C2 C4 C9-C11 = Capacitor_0805: 0805
C8 = Capacitor_Tantalum: 470 µF Molded Tantalum Capacitors 6.3 V 2917 (7343 Metric) 100mOhm.
F1 = Fuse: FUSE BRD MNT 10A 125VAC/VDC SMD | Littelfuse 0154010.DR.
J1 = PCB_Connector: Socket, DC supply, male, PIN: 2.; MF: AMASS; SnapEDA_Link: https://www.snapeda.com/parts/XT60PW-M/AMASS/view-part/?ref=snap; Package: Package; Value: *; MP: XT60PW-M; Check_prices: https://www.snapeda.com/parts/XT60PW-M/AMASS/view-part/?ref=eda
LED1 = LED_0603, GREEN: LED 0603, Green, 3.2 V, 20 mA, 430 mcd
R1 R3-R5 = Resistor_0603: 0603
R2 R6 = Resistor_1206: 1206
TP1-TP4 = Testpoint S2761-46R: as TP5 on sheet ESP32_S3_Wroom2_Schematic
U1 = DCDC_Converter: Module DC-DC 1-OUT 0.6V to 5V 15A Automotive 133-Pin BGA Tray.; MF: Analog Devices; SnapEDA_Link: https://www.snapeda.com/parts/LTM4627EY%23PBF/Analog+Devices/view-part/?ref=snap; Availability: In Stock; Purchase-URL: https://pricing.snapeda.com/search/part/LTM4627EY#PBF/?ref=eda; Check_prices: https://www.snapeda.com/parts/LTM4627EY%23PBF/Analog+Devices/view-part/?ref=eda; Value: *; Package: BGA -133 Analog Devices; MP: LTM4627EY#PBF; Price: None
U2 = LD1117S33CTR: LDO, 3.3V and 800mA.; ComponentLink1Description: Datasheet; ComponentLink1URL: chrome-extension://efaidnbmnnnibpcajpcglclefindmkaj/https://www.st.com/content/ccc/resource/technical/document/datasheet/99/3b/7d/91/91/51/4b/be/CD00000544.pdf/files/CD00000544.pdf/jcr:content/translations/en.CD00000544.pdf; ComponentLink2Description: Supplier; ComponentLink2URL: https://www.digikey.ch/en/products/detail/stmicroelectronics/LD1117S33CTR/585765

## Sheet Brightness_Sensor_Schematic.SchDoc
size A4; DocumentNumber: 6; SheetNumber: 6; SheetTotal: 6
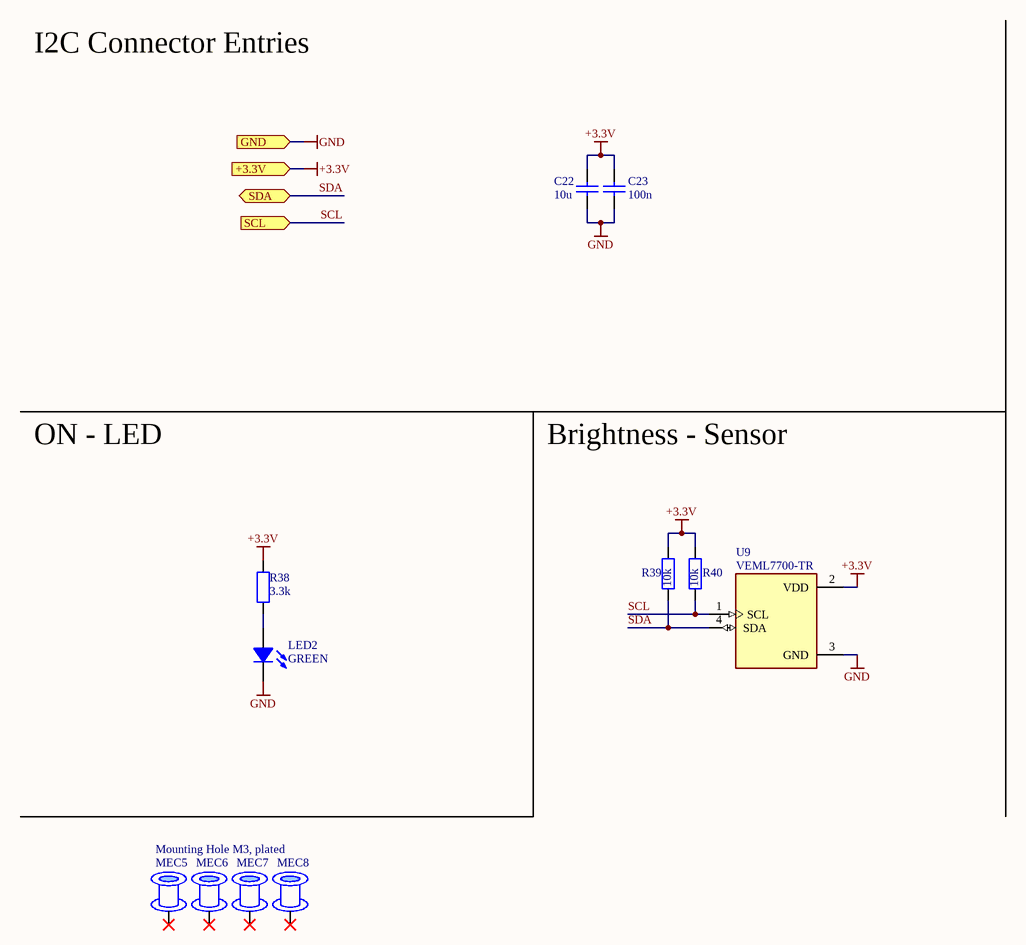
[diagram p5: Brightness_Sensor_Schematic.SchDoc]

### Parts
(Parts that share a designator on the sheet are numbered #1, #2 ... from top to bottom, then left to right.)
C22#2  10u  [0603_CAPACITOR]
C23#2  100n  [0603_CAPACITOR]
LED2  GREEN  [LED_0603, GREEN]
MEC5  Mounting Hole M3, plated  [Mounting Hole M3, plated]
MEC6  Mounting Hole M3, plated  [Mounting Hole M3, plated]  (value not drawn)
MEC7  Mounting Hole M3, plated  [Mounting Hole M3, plated]  (value not drawn)
MEC8  Mounting Hole M3, plated  [Mounting Hole M3, plated]  (value not drawn)
R38#2  3.3k  [0603_Resistor]
R39#2  10k  [0603_Resistor]
R40#2  10k  [0603_Resistor]
U9#2  VEML7700-TR  [Brightness_Sensor]

### Ports
+3.3V (in), GND (in), SCL (in), SDA (bidir)

### Nets
+3.3V: C22#2.2 C23#2.2 R38#2.2 R39#2.2 R40#2.2 U9#2.2(VDD) ; port +3.3V
GND: C22#2.1 C23#2.1 LED2.K U9#2.3(GND) ; port GND
SCL: R40#2.1 U9#2.1(SCL) ; port SCL
SDA: R39#2.1 U9#2.4(SDA) ; port SDA
NetLED2_A: LED2.A R38#2.1

Not connected (* = marked no-connect by the designer): MEC5 1*; MEC6 1*; MEC7 1*; MEC8 1*

### Notes on the sheet
- I2C Connector Entries
- ON - LED
- Brightness - Sensor
- Date:
- Title of drawing:
- Time:
- Drawn by:
- Project:
- Revision:
- Institut:
- Departement:
- Page:
- from:
- File:

### Library data of the parts
C22#2 C23#2 = Capacitor: 0603
LED2 = LED_0603, GREEN: LED 0603, Green, 3.2 V, 20 mA, 430 mcd
MEC5-MEC8 = Mounting Hole M3, plated: as MEC1 on sheet Blackbox_BauhallenUhr_Schematic
R38#2 R39#2 R40#2 = Resistor: 0603
U9#2 = Brightness_Sensor: SENSOR OPT 545NMAMB 4 SMD J LEAD.; ComponentLink1Description: Supplier; ComponentLink1URL: https://www.digikey.ch/en/products/detail/vishay-semiconductor-opto-division/VEML7700-TR/5820243

## Nets that join several sheets
+3.3V: St3025_Servo_Schematic (8 pins), ESP32_S3_Wroom2_Schematic (24 pins), Power_Supply_Schematic (R6.2 TP3.1), Brightness_Sensor_Schematic (6 pins)
+5V: ESP32_S3_Wroom2_Schematic (D7.1 R14.1 U3.4), LED_16x_Schematic (12 pins), Power_Supply_Schematic (46 pins)
+12V: St3025_Servo_Schematic (J6.2), Power_Supply_Schematic (25 pins)
GND: St3025_Servo_Schematic (6 pins), ESP32_S3_Wroom2_Schematic (36 pins), LED_16x_Schematic (24 pins), Power_Supply_Schematic (67 pins), Brightness_Sensor_Schematic (C22#2.1 C23#2.1 LED2.K U9#2.3)
U1_RXD: St3025_Servo_Schematic (R40#1.1 U9#1.4), ESP32_S3_Wroom2_Schematic (U7.11)
U1_TXD: St3025_Servo_Schematic (R35.2 R38#1.1 U8.2), ESP32_S3_Wroom2_Schematic (U7.10)

## Assembly variants
Standard-Variant: all parts fitted
All-Components: all parts fitted